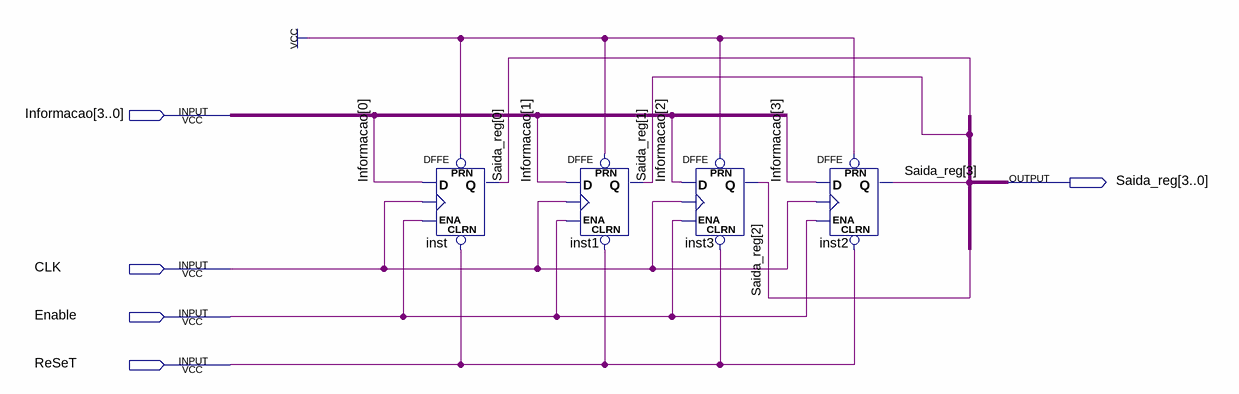
[diagram p0: schematic sheet]
// Quartus schematic reg4bits.bdf as structural Verilog: 4 symbols, 5 pins
module reg4bits (
  input  [3:0] Informacao,
  input  CLK,
  input  Enable,
  input  ReSeT,
  output [3:0] Saida_reg
);

  DFFE inst (.PRN(1'b1), .CLRN(ReSeT), .D(Informacao[0]), .CLK(CLK), .ENA(Enable), .Q(Saida_reg[0]));
  DFFE inst1 (.PRN(1'b1), .CLRN(ReSeT), .D(Informacao[1]), .CLK(CLK), .ENA(Enable), .Q(Saida_reg[1]));
  DFFE inst3 (.PRN(1'b1), .CLRN(ReSeT), .D(Informacao[2]), .CLK(CLK), .ENA(Enable), .Q(Saida_reg[2]));
  DFFE inst2 (.PRN(1'b1), .CLRN(ReSeT), .D(Informacao[3]), .CLK(CLK), .ENA(Enable), .Q(Saida_reg[3]));
endmodule
